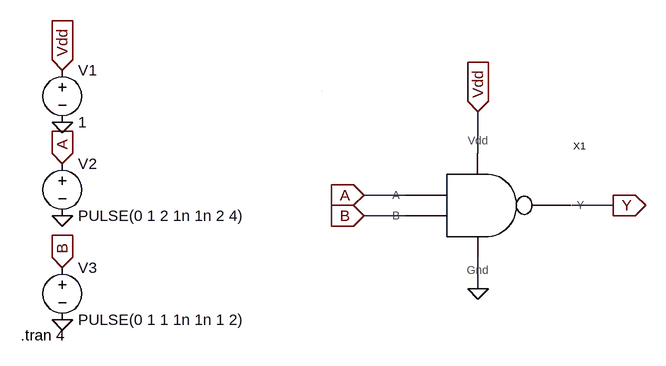
[diagram p0: schematic nand_test.asc]
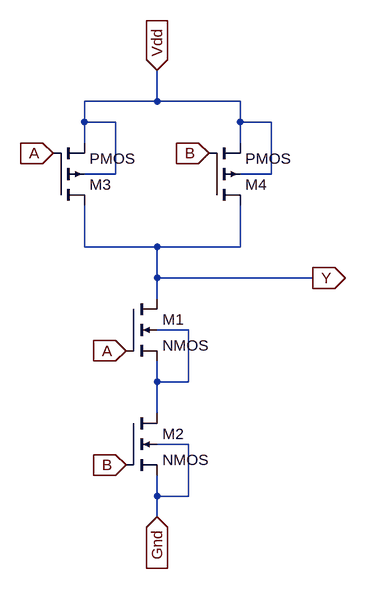
[diagram p1: sub-circuit nand.asc]
nand_test.asc, the LTspice schematic file:
Version 4
SHEET 1 880 680
WIRE 240 96 240 32
WIRE 128 160 64 160
WIRE 448 176 384 176
WIRE 128 192 64 192
WIRE 240 304 240 256
WIRE 0 0 0 0
FLAG -400 -32 Vdd
IOPIN -400 -32 In
FLAG -400 112 A
IOPIN -400 112 In
FLAG -400 272 B
IOPIN -400 272 In
FLAG -400 48 0
FLAG -400 192 0
FLAG -400 352 0
FLAG 64 160 A
IOPIN 64 160 In
FLAG 64 192 B
IOPIN 64 192 In
FLAG 240 32 Vdd
IOPIN 240 32 In
FLAG 240 304 0
FLAG 448 176 Y
IOPIN 448 176 Out
SYMBOL nand 240 160 R0
SYMATTR InstName X1
SYMBOL voltage -400 -48 R0
SYMATTR InstName V1
SYMATTR Value 1
SYMBOL voltage -400 96 R0
WINDOW 123 0 0 Left 0
WINDOW 39 0 0 Left 0
SYMATTR InstName V2
SYMATTR Value PULSE(0 1 2 1n 1n 2 4)
SYMBOL voltage -400 256 R0
WINDOW 123 0 0 Left 0
WINDOW 39 0 0 Left 0
SYMATTR InstName V3
SYMATTR Value PULSE(0 1 1 1n 1n 1 2)
TEXT -464 376 Left 2 !.tran 4

nand.asc, the sub-circuit schematic file:
Version 4
SHEET 1 880 680
WIRE 192 -176 192 -224
WIRE 192 -176 80 -176
WIRE 320 -176 192 -176
WIRE 80 -144 80 -176
WIRE 128 -144 80 -144
WIRE 320 -144 320 -176
WIRE 368 -144 320 -144
WIRE 80 -112 80 -144
WIRE 320 -112 320 -144
WIRE 128 -64 128 -144
WIRE 128 -64 80 -64
WIRE 368 -64 368 -144
WIRE 368 -64 320 -64
WIRE 80 48 80 -16
WIRE 192 48 80 48
WIRE 320 48 320 -16
WIRE 320 48 192 48
WIRE 192 96 192 48
WIRE 432 96 192 96
WIRE 192 128 192 96
WIRE 240 176 192 176
WIRE 192 256 192 224
WIRE 240 256 240 176
WIRE 240 256 192 256
WIRE 192 304 192 256
WIRE 240 352 192 352
WIRE 192 432 192 400
WIRE 240 432 240 352
WIRE 240 432 192 432
WIRE 192 464 192 432
FLAG 192 464 Gnd
IOPIN 192 464 In
FLAG 144 384 B
IOPIN 144 384 In
FLAG 144 208 A
IOPIN 144 208 In
FLAG 32 -96 A
IOPIN 32 -96 In
FLAG 272 -96 B
IOPIN 272 -96 In
FLAG 432 96 Y
IOPIN 432 96 Out
FLAG 192 -224 Vdd
IOPIN 192 -224 In
SYMBOL nmos4 144 128 R0
SYMATTR InstName M1
SYMBOL nmos4 144 304 R0
SYMATTR InstName M2
SYMBOL pmos4 32 -16 M180
SYMATTR InstName M3
SYMBOL pmos4 272 -16 M180
SYMATTR InstName M4

The netlist it stands for:
* nand_test.asc
XX1 A B Vdd 0 Y nand
V1 Vdd 0 1
V2 A 0 PULSE(0 1 2 1n 1n 2 4)
V3 B 0 PULSE(0 1 1 1n 1n 1 2)

* block symbol definitions
.subckt nand A B Vdd Gnd Y
M1 Y A N001 N001 NMOS
M2 N001 B Gnd Gnd NMOS
M3 Y A Vdd Vdd PMOS
M4 Y B Vdd Vdd PMOS
.ends nand

.model NMOS NMOS
.model PMOS PMOS
.lib standard.mos
.tran 4
.backanno
.end

* Results of the author's LTspice run, read from the files saved beside the schematic
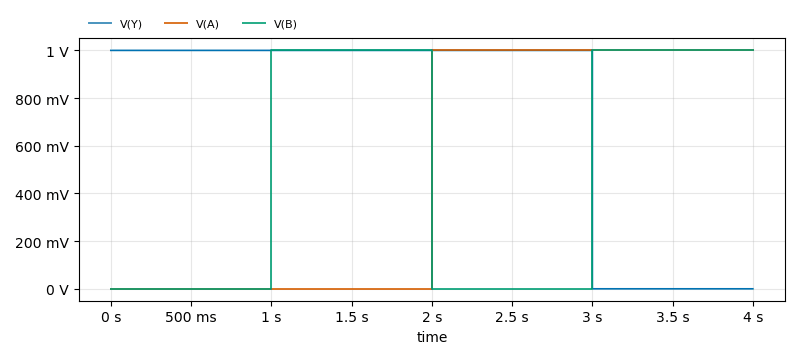
[diagram p2: Transient Analysis of nand_test.asc, plotted from the saved traces]
* Transient Analysis, 1 run:
*   V(Y): min -406.4 nV, max 1 V, average 750 mV, rms 866 mV, last 402 nV
*   V(A): min 0 V, max 1 V, average 500 mV, rms 707.1 mV, last 1 V
*   V(B): min 0 V, max 1 V, average 500 mV, rms 707.1 mV, last 1 V